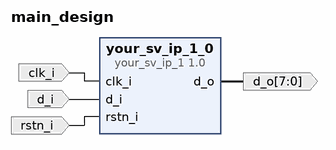
[diagram p0: block diagram of the top level]
# Vivado block design main_design, xcku060-ffva1156-1-i, Vivado 2025.2
create_bd_design main_design

create_bd_port -dir I -type clk clk_i
create_bd_port -dir I d_i
create_bd_port -dir O -from 7 -to 0 d_o
create_bd_port -dir I -type rst rstn_i
set_property -dict {CONFIG.POLARITY ACTIVE_LOW} [get_bd_ports rstn_i]

create_bd_cell -type ip -vlnv xilinx.com:user:your_sv_ip_1:1.0 your_sv_ip_1_0

# ---- connections ----

connect_bd_net -net clk_i_net [get_bd_ports clk_i] [get_bd_pins your_sv_ip_1_0/clk_i]
connect_bd_net -net d_i_net [get_bd_ports d_i] [get_bd_pins your_sv_ip_1_0/d_i]
connect_bd_net -net d_o_net [get_bd_pins your_sv_ip_1_0/d_o] [get_bd_ports d_o]
connect_bd_net -net rstn_i_net [get_bd_ports rstn_i] [get_bd_pins your_sv_ip_1_0/rstn_i]

validate_bd_design
save_bd_design
